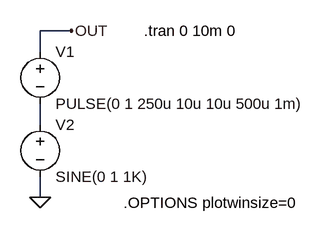
[diagram p0: schematic Fig_4-34_Sample_EQU-Time-Step.asc]
Fig_4-34_Sample_EQU-Time-Step.asc, the LTspice schematic file:
Version 4
SHEET 1 880 680
WIRE 144 64 96 64
WIRE 96 96 96 64
WIRE 96 208 96 176
WIRE 96 320 96 288
FLAG 96 320 0
FLAG 144 64 OUT
SYMBOL voltage 96 80 R0
WINDOW 123 0 0 Left 2
WINDOW 39 0 0 Left 2
SYMATTR InstName V1
SYMATTR Value PULSE(0 1 250u 10u 10u 500u 1m)
SYMBOL voltage 96 192 R0
WINDOW 123 0 0 Left 2
WINDOW 39 0 0 Left 2
SYMATTR InstName V2
SYMATTR Value SINE(0 1 1K)
TEXT 256 64 Left 2 !.tran 0 10m 0
TEXT 224 328 Left 2 !.OPTIONS plotwinsize=0

The netlist it stands for:
* Fig_4-34_Sample_EQU-Time-Step.asc
V1 OUT N001 PULSE(0 1 250u 10u 10u 500u 1m)
V2 N001 0 SINE(0 1 1K)
.tran 0 10m 0
.OPTIONS plotwinsize=0
.backanno
.end